# Altium schematic sheet SCH_EECD1_2_2023-01-18.schdoc
size 285 x 204 mm
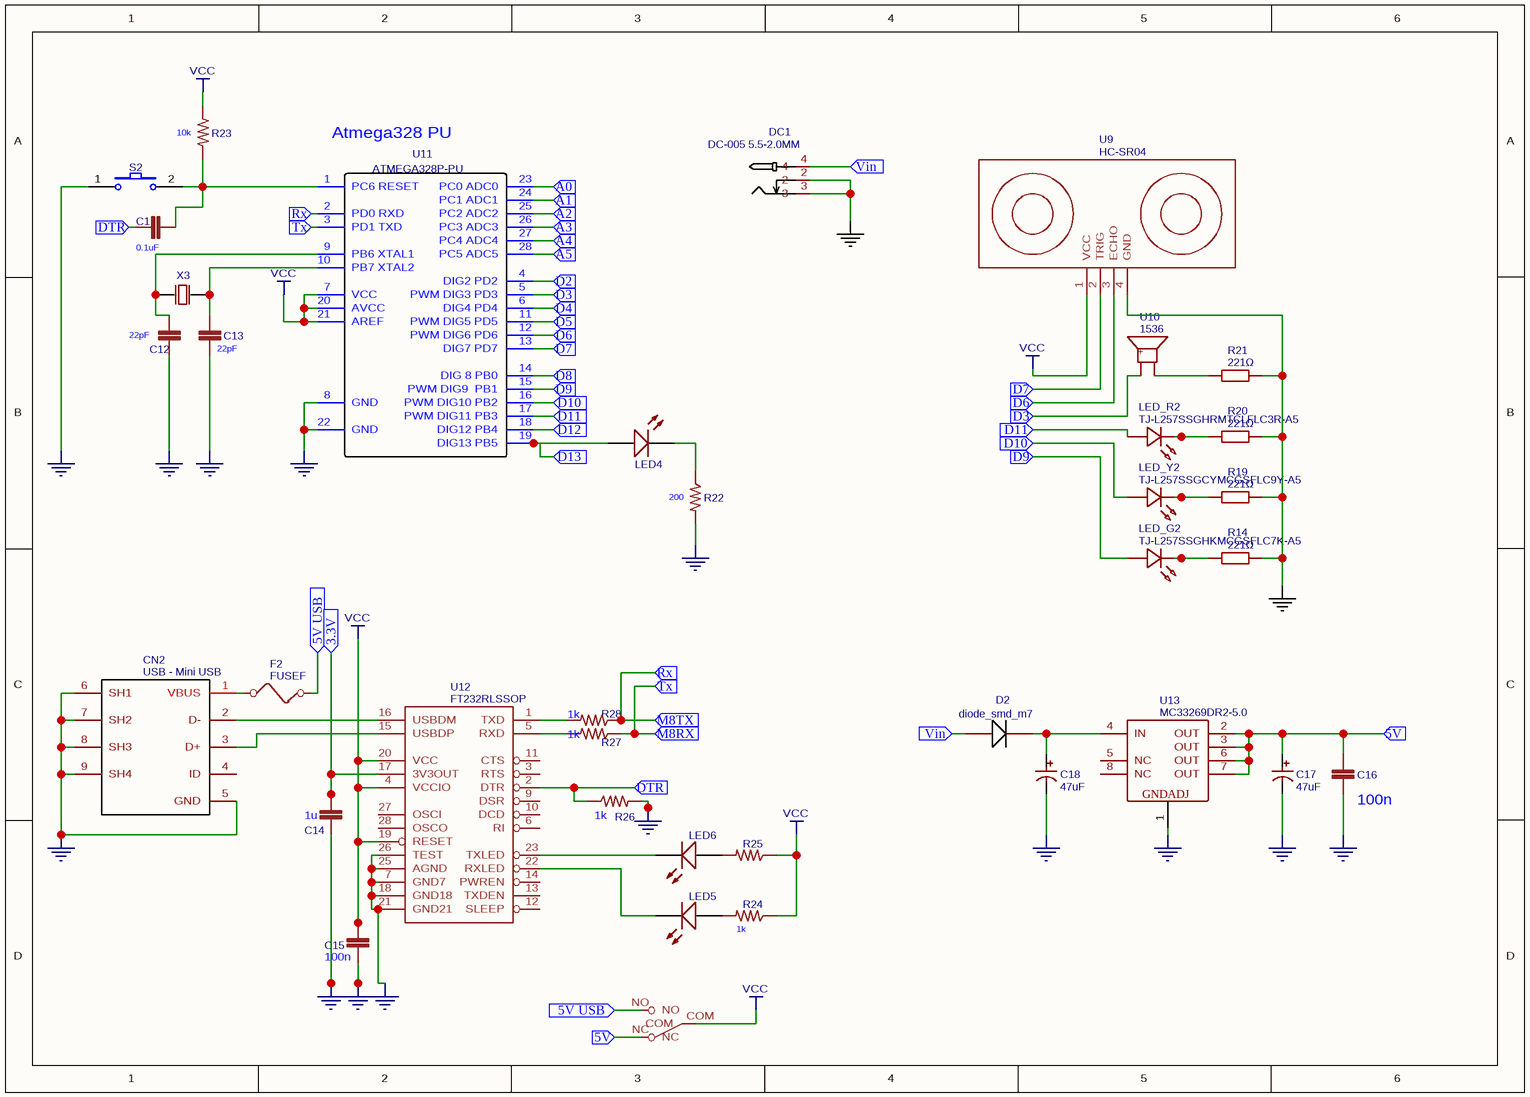
[diagram p0: SCH_EECD1_2_2023-01-18.schdoc]

## Parts
C11  CAPACITOR_NPOL-0805  [C805]  (value not drawn)
C12  CAPACITOR_NPOL-0805  [C805]  (value not drawn)
C13  CAPACITOR_NPOL-0805  [C805]  (value not drawn)
C14  CAPACITOR_NPOL-0805  [C805]  (value not drawn)
C15  CAPACITOR_NPOL-0805  [C805]  (value not drawn)
C16  CAPACITOR_NPOL-0805  [C805]  (value not drawn)
C17  47uF  [PANASONIC SMD CAP SIZE D]
C18  47uF  [PANASONIC SMD CAP SIZE D]
CN2  USB - Mini USB  [MINI USB]
D2  diode_smd_m7  [DIODE_SMD_M7]
DC1  DC-005 5.5-2.0MM  [DC-IN-TH_DC-5520-1]
F2  FUSEF  [1812]
LED4  17-21/GHC-YR1S2/3T  [LED-0805]  (value not drawn)
LED5  17-21/GHC-YR1S2/3T  [LED-0805]  (value not drawn)
LED6  17-21/GHC-YR1S2/3T  [LED-0805]  (value not drawn)
LED_G2  TJ-L257SSGHKMCGSFLC7K-A5  [LED-TH_L5.0-W2.0-RD]
LED_R2  TJ-L257SSGHRMTCLFLC3R-A5  [LED-TH_L5.0-W2.6-P2.54-RD_RED]
LED_Y2  TJ-L257SSGCYMCGSFLC9Y-A5  [LED-TH_L5.0-W2.6-RD]
R14  221Ω  [R0402]
R19  221Ω  [R0402]
R20  221Ω  [R0402]
R21  221Ω  [R0402]
R22  200  [0805]  (value not drawn)
R23  0.22OHM-1_4W-1%(0805)  [0805]  (value not drawn)
R24  200  [0805]  (value not drawn)
R25  200  [0805]  (value not drawn)
R26  200  [0805]  (value not drawn)
R27  200  [0805]  (value not drawn)
R28  200  [0805]  (value not drawn)
S2  Button1  [SMD PUSH BUTTON]  (value not drawn)
SW2  SW-SLIDE  [SLIDE_SWITCH_SMD]  (value not drawn)
U9  HC-SR04  [HC-SR04]
U10  1536  [BUZ-SMD_BUZZER]
U11  ATMEGA328P-PU  [DIP-28_300MIL]
U12  FT232RLSSOP  [SSOP28DB]
U13  MC33269DR2-5.0  [SOIC-8_150MIL]
X3  16MHZ  [OSC-49S-1]  (value not drawn)

## Ports
3.3V (in), 5V (in), 5V USB (in), A0 (in), A1 (in), A2 (in), A3 (in), A4 (in), A5 (in), D2 (in), D3 (in), D4 (in), D5 (in), D6 (in), D7 (in), D8 (in), D9 (in), D10 (in), D11 (in), D12 (in), D13 (in), DTR (in), M8RX (in), M8TX (in), Rx (in), Tx (in), Vin (in)

## Nets
GND: C12.1 C13.2 C14.2 C15.2 C16.2 C17.2 C18.2 CN2.5(GND) CN2.6(SH1) CN2.7(SH2) CN2.8(SH3) CN2.9(SH4) DC1.2 DC1.3 R14.2 R19.2 R20.2 R21.2 R22.2 R26.2 S2.1 U9.4(GND) U11.8(GND) U11.22(GND) U12.7(GND7) U12.18(GND18) U12.21(GND21) U12.25(AGND) U12.26(TEST) U13.1(GNDADJ)
VCC: C15.1 R23.2 R24.1 R25.1 SW2.COM U9.1(VCC) U11.7(VCC) U11.20(AVCC) U11.21(AREF) U12.4(VCCIO) U12.19(RESET) U12.20(VCC)
3.3V: C14.1 U12.17(3V3OUT) ; port 3.3V
5V: C16.1 C17.1 SW2.NC U13.2(OUT) U13.3(OUT) U13.6(OUT) U13.7(OUT) ; port 5V
5V USB: F2.2 SW2.NO ; port 5V USB
A0: U11.23(PC0_ADC0) ; port A0
A1: U11.24(PC1_ADC1) ; port A1
A2: U11.25(PC2_ADC2) ; port A2
A3: U11.26(PC3_ADC3) ; port A3
A4: U11.27(PC4_ADC4) ; port A4
A5: U11.28(PC5_ADC5) ; port A5
D2: U11.4(DIG2_PD2) ; port D2
D3: U10.2(+) U11.5(PWM_DIG3_PD3) ; port D3
D4: U11.6(DIG4_PD4) ; port D4
D5: U11.11(PWM_DIG5_PD5) ; port D5
D6: U9.3(ECHO) U11.12(PWM_DIG6_PD6) ; port D6
D7: U9.2(TRIG) U11.13(DIG7_PD7) ; port D7
D8: U11.14(DIG_8_PB0) ; port D8
D9: LED_G2.2(A) U11.15(PWM_DIG9__PB1) ; port D9
D10: LED_Y2.2(+) U11.16(PWM_DIG10_PB2) ; port D10
D11: LED_R2.2(+) U11.17(PWM_DIG11_PB3) ; port D11
D12: U11.18(DIG12_PB4) ; port D12
D13: LED4.1(A) U11.19(DIG13_PB5) ; port D13
DTR: C11.1 R26.1 U12.2(DTR) ; port DTR
M8RX: R27.1 U11.3(PD1_TXD) ; port Tx, port M8RX
M8TX: R28.1 U11.2(PD0_RXD) ; port Rx, port M8TX
Vin: D2.2(анод) DC1.4 ; port Vin
NetC11_2: C11.2 R23.1 S2.2 U11.1(PC6_RESET)
NetC12_2: C12.2 U11.9(PB6_XTAL1) X3.2(OSC2)
NetC13_1: C13.1 U11.10(PB7_XTAL2) X3.1(OSC1)
NetC18_1: C18.1 D2.1(катод) U13.4(IN)
NetCN2_1: CN2.1(VBUS) F2.1
NetCN2_2: CN2.2(D-) U12.16(USBDM)
NetCN2_3: CN2.3(D+) U12.15(USBDP)
NetLED4_2: LED4.2(C) R22.1
NetLED5_1: LED5.1(A) R24.2
NetLED5_2: LED5.2(C) U12.22(RXLED)
NetLED6_1: LED6.1(A) R25.2
NetLED6_2: LED6.2(C) U12.23(TXLED)
NetLED_G2_1: LED_G2.1(K) R14.1
NetLED_R2_1: LED_R2.1(-) R20.1
NetLED_Y2_1: LED_Y2.1(-) R19.1
NetR21_1: R21.1 U10.1
NetR27_2: R27.2 U12.5(RXD)
NetR28_2: R28.2 U12.1(TXD)

Not connected (* = marked no-connect by the designer): CN2 4(ID); U12 3(RTS) 6(RI) 9(DSR) 10(DCD) 11(CTS) 12(SLEEP) 13(TXDEN) 14(PWREN) 27(OSCI) 28(OSCO); U13 5(NC) 8(NC)

## Notes on the sheet
- (near R23) 10k
- (near U11) Atmega328 PU
- (near C11) 0.1uF
- (near C12) 22pF
- (near C13) 22pF
- (near R22) 200
- (near R28) 1k
- (near R27) 1k
- (near C14) 1u
- (near R26) 1k
- (near C16) 100n
- (near C15) 100n
- (near R24) 1k

## Library data of the parts
C11-C16 = CAPACITOR_NPOL-0805: catid: 20; description: Non-Polarized capacitor in various packages; Contributor: DangerousPrototype; BOM_Manufacturer Part: ?; spicePre: C
C17 C18 = 47uF: BOM_Manufacturer: Panasonic; BOM_Manufacturer Part: EEE-HD1C470AP; Voltage: 63V; Tolerance: ±20%; Value: 47uF; BOM_Supplier: Mouser; BOM_LCSC: C82011; spicePre: C
CN2 = USB - Mini USB: Contributor: suwanp; BOM_Manufacturer Part: USB - Mini USB; link: https://www.es.co.th/Schemetic/PDF/MUMRB05FTKN.PDF; spicePre: C
D2 = diode_smd_m7: nameAlias: Model; Contributor: kova128388; spicePre: X; BOM_Manufacturer Part: ?; spiceSymbolName: diode_smd_m7
DC1 = DC-005 5.5-2.0MM: BOM_Manufacturer: BOOMELE(博穆精密); BOM_Manufacturer Part: DC-005 2.0; BOM_Supplier: LCSC; BOM_Supplier Part: C16214; BOM_JLCPCB Part Class: Extended Part; spicePre: D; spiceSymbolName: DC-005 5.5-2.0MM
LED4-LED6 = 17-21/GHC-YR1S2/3T: BOM_Manufacturer: EVERLIGHT; BOM_Supplier: EasyEDA; BOM_Manufacturer Part: 17-21/GHC-YR1S2/3T; spicePre: L; BOM_Supplier Part: E73546
LED_G2 = TJ-L257SSGHKMCGSFLC7K-A5: BOM_Manufacturer: TOGIALED(统佳); Contributor: LCSC; BOM_Supplier: LCSC; BOM_Supplier Part: C331044; BOM_Manufacturer Part: TJ-L257SSGHKMCGSFLC7K-A5; BOM_JLCPCB Part Class: Extended Part; spicePre: L; spiceSymbolName: TJ-L257SSGHKMCGSFLC7K-A5
LED_R2 = TJ-L257SSGHRMTCLFLC3R-A5: BOM_Manufacturer: TOGIALED(统佳); Contributor: LCSC; BOM_Supplier: LCSC; BOM_Supplier Part: C331042; BOM_Manufacturer Part: TJ-L257SSGHRMTCLFLC3R-A5; BOM_JLCPCB Part Class: Extended Part; spicePre: L; spiceSymbolName: TJ-L257SSGHRMTCLFLC3R-A5
LED_Y2 = TJ-L257SSGCYMCGSFLC9Y-A5: BOM_Manufacturer: TOGIALED(统佳); Contributor: LCSC; BOM_Supplier: LCSC; BOM_Supplier Part: C330771; BOM_Manufacturer Part: TJ-L257SSGCYMCGSFLC9Y-A5; BOM_JLCPCB Part Class: Extended Part; spicePre: L; spiceSymbolName: TJ-L257SSGCYMCGSFLC9Y-A5
R14 R19-R21 = 221Ω: BOM_Manufacturer: FH(风华); BOM_Manufacturer Part: RC-02W103JT; Resistance (Ohms): 10K; nameAlias: Resistance; Contributor: LCSC; BOM_Supplier: LCSC; BOM_Supplier Part: C140214; BOM_JLCPCB Part Class: Extended Part; spicePre: R; spiceSymbolName: RC-02W103JT_C140214
R22 R24-R28 = 200: catid: 20; description: RES-09883; Contributor: SparkFun; BOM_Manufacturer Part: ?; spicePre: R
R23 = 0.22OHM-1_4W-1%(0805): catid: 20; description: RES-09883; Contributor: SparkFun; BOM_Manufacturer Part: ?; spicePre: R
S2 = Button1: catid: 20; sourceId: K60iAuM3l; timeStamp: 1459264135; BOM_Manufacturer Part: ?; spicePre: S
SW2 = SW-SLIDE: Contributor: DangerousPrototype; sourceId: UQOaKjhfd; timeStamp: 1472876621; BOM_Manufacturer Part: ?; spicePre: S
U9 = HC-SR04: Contributor: MicroRobotics; BOM_Manufacturer: HC-SR04; BOM_Supplier Part: HC-SR04; BOM_Supplier: Micro Robotics; link: https://www.robotics.org.za/HC-SR04; spicePre: U; spiceSymbolName: HC-SR04
U10 = 1536: BOM_Manufacturer: null; BOM_Manufacturer Part: BUZZER; Contributor: lcsc; BOM_Supplier: LCSC; BOM_Supplier Part: C9900021864; BOM_JLCPCB Part Class: Extended Part; spicePre: U; spiceSymbolName: BUZZER_C9900021864
U11 = ATMEGA328P-PU: BOM_Manufacturer: ATMEL; catid: 20; sourceId: Oic6oiASL; timeStamp: 1451725987; BOM_Supplier: LCSC; BOM_Manufacturer Part: ATMEGA328P-PU; spicePre: U; BOM_Supplier Part: C33901
U12 = FT232RLSSOP: description: USB UART; Contributor: SparkFun; BOM_Manufacturer Part: ?; spicePre: U
U13 = MC33269DR2-5.0: BOM_Manufacturer: ON; BOM_Manufacturer Part: MC33269DR2-3.3; BOM_Supplier: LCSC; image: //image.lceda.cn/szlcsc/C7301.jpg; spicePre: U; BOM_Supplier Part: C7301
X3 = 16MHZ: BOM_Manufacturer: YXC; BOM_Manufacturer Part: X49SD16MSD2SC; Value: 16MHZ; BOM_Supplier: LCSC; spicePre: X; BOM_Supplier Part: C16212
F2 = FUSEF: BOM_Manufacturer Part: ?; spicePre: F